# EAGLE design antenna_tracker (EAGLE 6.5.0)
DATABASE: C:/Users/Brandon Beggs/Documents/Projects/Utilities/digikeydb.txt

## Sheet 1 of 5
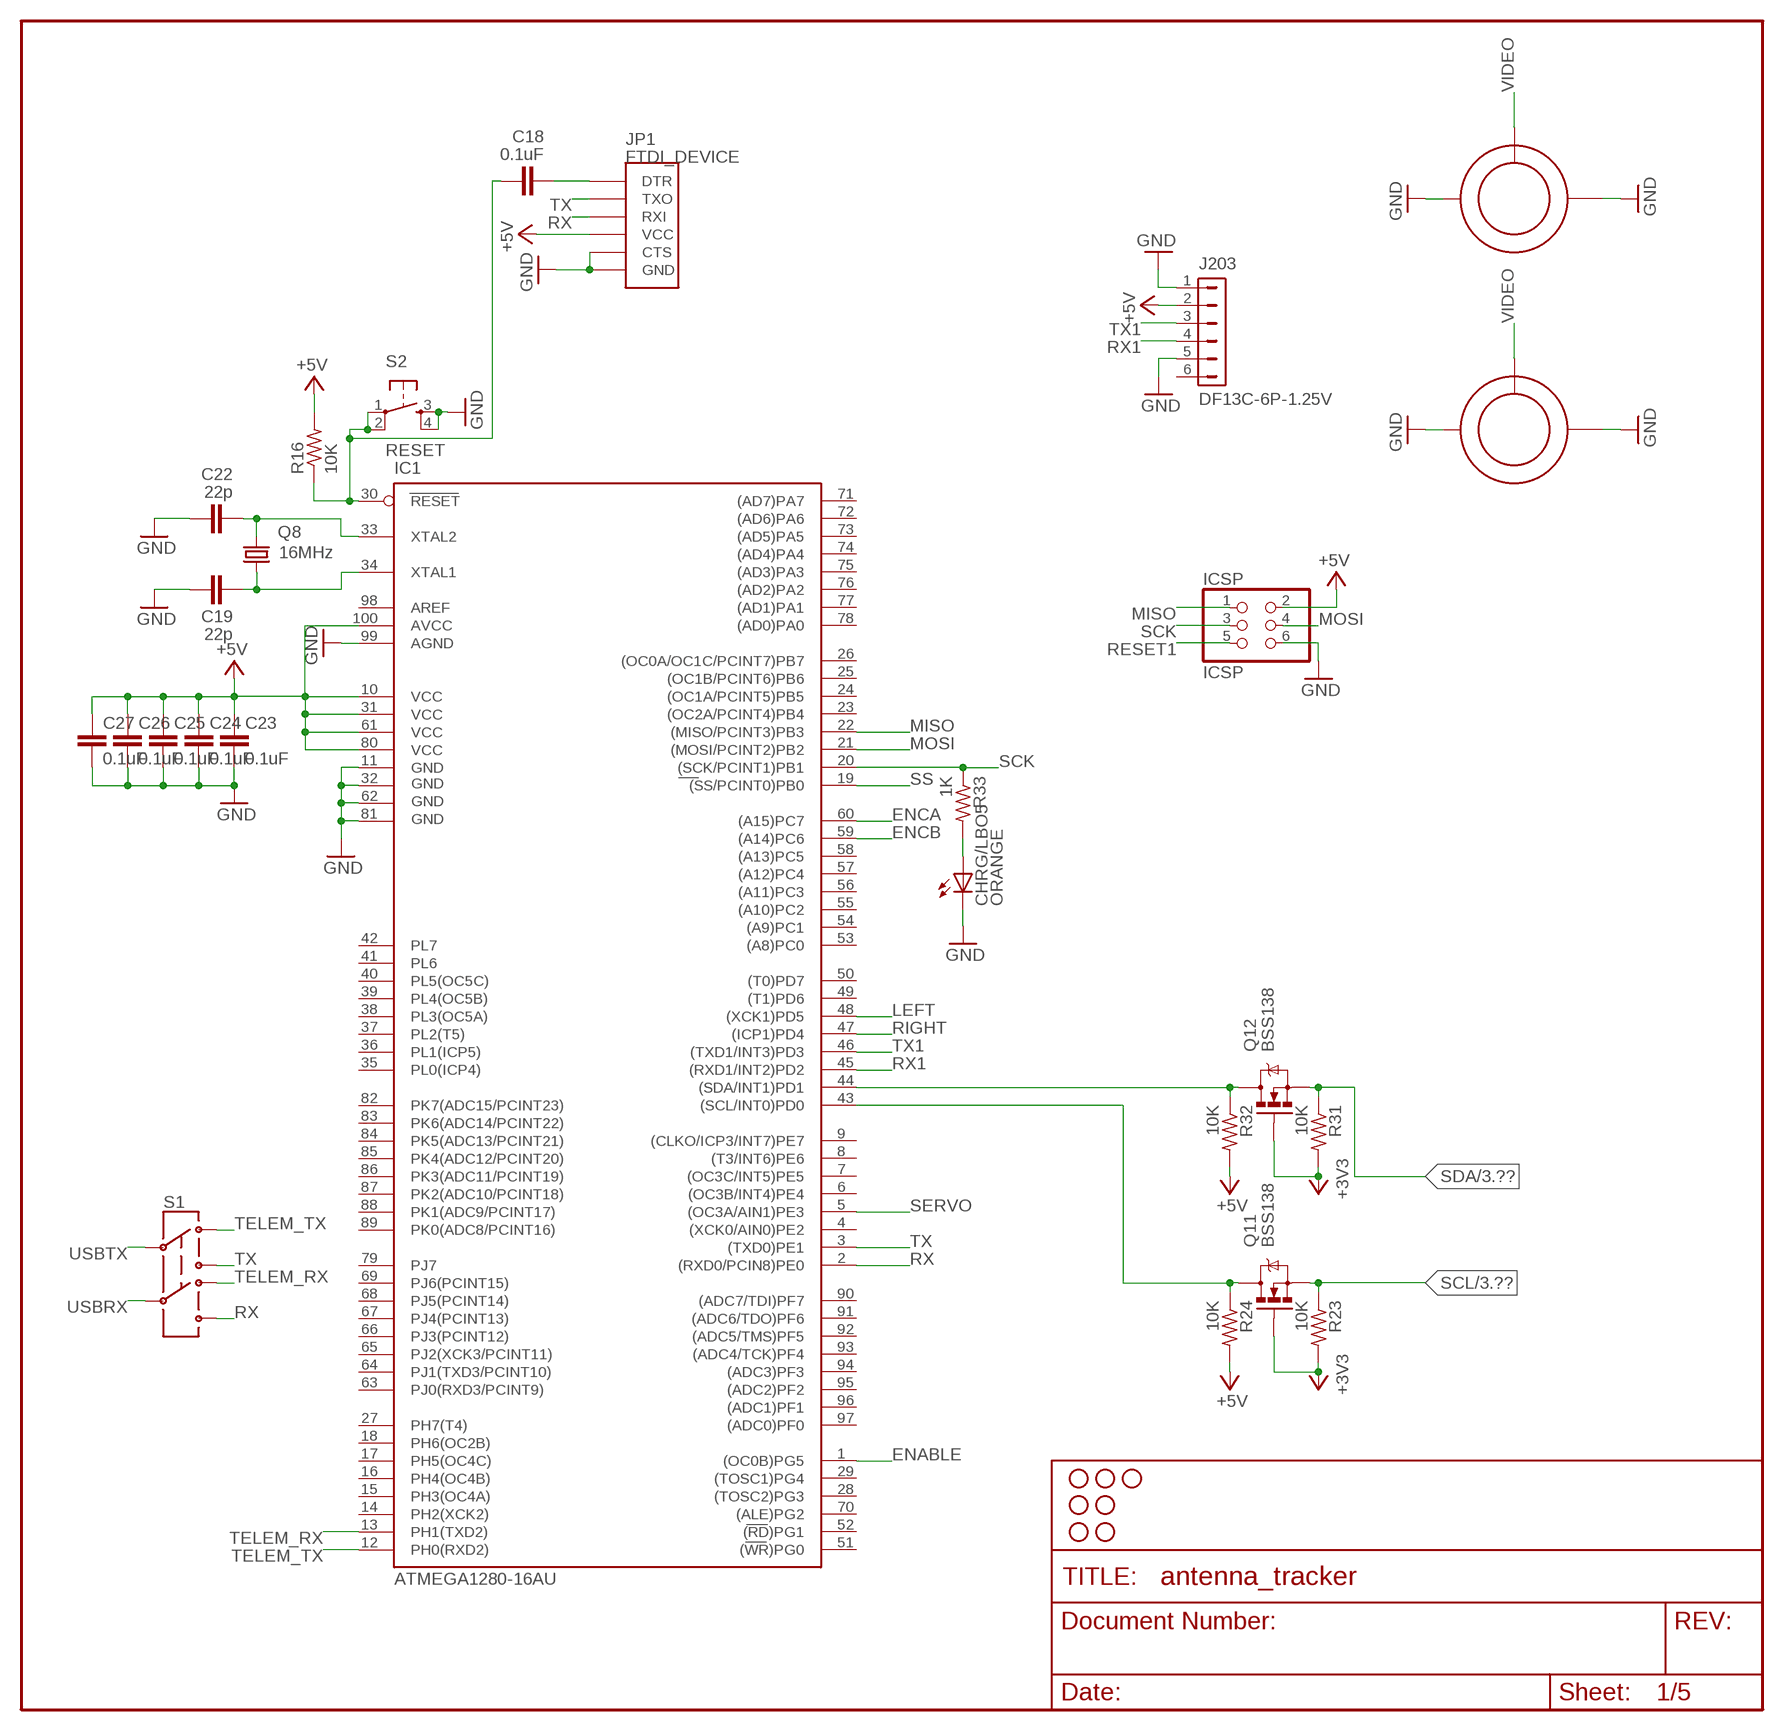
[diagram p0: schematic, sheet 1]

### Parts
C18  0.1uF  C-EUC0603K  [C0603K]
C19  22p  C-EUC0603K  [C0603K]
C22  22p  C-EUC0603K  [C0603K]
C23  0.1uF  C-EUC0603K  [C0603K]
C24  0.1uF  C-EUC0603K  [C0603K]
C25  0.1uF  C-EUC0603K  [C0603K]
C26  0.1uF  C-EUC0603K  [C0603K]
C27  0.1uF  C-EUC0603K  [C0603K]
CHRG/LBO5  ORANGE  LEDCHIP-LED0805  [CHIP-LED0805]
IC1  ATMEGA1280-16AU  [TQFP100]
ICSP  ICSP  PINHD-2X3  [2X03]
J203  DF13C-6P-1.25V  DF13-6P-1.25V  [DF13C-6P-1.25V]
JP1  FTDI_DEVICE  [FTDI_DEVICE_SIDE]
Q8  16MHz  CRYTALHC49S  [HC49/S]
Q11  BSS138  BSS138TRANS-00830  [SOT23-3]
Q12  BSS138  BSS138TRANS-00830  [SOT23-3]
R16  10K  R-US_R0805  [R0805]
R23  10K  R-US_R0805  [R0805]
R24  10K  R-US_R0805  [R0805]
R31  10K  R-US_R0805  [R0805]
R32  10K  R-US_R0805  [R0805]
R33  1K  R-US_M0805  [M0805]
S1  SWITCH-DPDTPTH  [MSS22]
S2  RESET  TAC_SWITCHPTH  [TACTILE-PTH]
STANDOFF1  STAND-OFF  [STAND-OFF]
STANDOFF2  STAND-OFF  [STAND-OFF]
STANDOFF3  STAND-OFF  [STAND-OFF]
STANDOFF4  STAND-OFF  [STAND-OFF]
STANDOFF5  STAND-OFF  [STAND-OFF]
STANDOFF6  STAND-OFF  [STAND-OFF]
STANDOFF7  STAND-OFF  [STAND-OFF]
U$10  RCA_VERTICAL  [RCA_VERTICAL]
U$11  RCA_VERTICAL  [RCA_VERTICAL]

### Nets
+3V3: Q11.1(G) Q12.1(G) R23.2 R31.2 ; also sheet 3,4
+5V: C23.1 C24.1 C25.1 C26.1 C27.1 IC1.10(VCC) IC1.31(VCC1) IC1.61(VCC2) IC1.80(VCC3) IC1.100(AVCC) ICSP.2 J203.2 JP1.P$4(VCC) R16.2 R24.2 R32.2 ; also sheet 2,4,5
ENABLE: IC1.1((OC0B)PG5) ; also sheet 2
ENCA: IC1.60((A15)PC7) ; also sheet 2
ENCB: IC1.59((A14)PC6) ; also sheet 2
GND: C19.1 C22.1 C23.2 C24.2 C25.2 C26.2 C27.2 CHRG/LBO5.C IC1.11(GND) IC1.32(GND1) IC1.62(GND2) IC1.81(GND3) IC1.99(AGND) ICSP.6 J203.1 J203.5 JP1.P$5(CTS) JP1.P$6(GND) S2.3 S2.4 U$10.P$1(GND) U$10.P$2(GND) U$11.P$1(GND) U$11.P$2(GND) ; also sheet 2,3,4,5
LEFT: IC1.48((XCK1)PD5) ; also sheet 2
MISO: IC1.22((MISO/PCINT3)PB3) ICSP.1
MOSI: IC1.21((MOSI/PCINT2)PB2) ICSP.4
N$18: C18.2 JP1.P$1(DTR)
N$20: C19.2 IC1.34(XTAL1) Q8.1
N$21: C22.2 IC1.33(XTAL2) Q8.2
N$22: IC1.44((SDA/INT1)PD1) Q12.3(D) R32.1
N$24: IC1.43((SCL/INT0)PD0) Q11.3(D) R24.1
N$27: CHRG/LBO5.A R33.2
RESET1: C18.1 IC1.30(RESET) ICSP.5 R16.1 S2.1 S2.2
RIGHT: IC1.47((ICP1)PD4) ; also sheet 2
RX: IC1.2((RXD0/PCIN8)PE0) JP1.P$3(RXI) S1.6
RX1: IC1.45((RXD1/INT2)PD2) J203.4
SCK: IC1.20((SCK/PCINT1)PB1) ICSP.3 R33.1
SCL: Q11.2(S) R23.1 ; also sheet 3
SDA: Q12.2(S) R31.1 ; also sheet 3
SERVO: IC1.5((OC3A/AIN1)PE3) ; also sheet 5
SS: IC1.19((SS/PCINT0)PB0)
TELEM_RX: IC1.13(PH1(TXD2)) S1.4 ; also sheet 4
TELEM_TX: IC1.12(PH0(RXD2)) S1.1 ; also sheet 4
TX: IC1.3((TXD0)PE1) JP1.P$2(TXO) S1.3
TX1: IC1.46((TXD1/INT3)PD3) J203.3
USBRX: S1.5 ; also sheet 4
USBTX: S1.2 ; also sheet 4
VIDEO: U$10.P$3(SIGNAL) U$11.P$3(SIGNAL) ; also sheet 4
Unconnected: IC1.4((XCK0/AIN0)PE2) IC1.6((OC3B/INT4)PE4) IC1.7((OC3C/INT5)PE5) IC1.8((T3/INT6)PE6) IC1.9((CLKO/ICP3/INT7)PE7) IC1.14(PH2(XCK2)) IC1.15(PH3(OC4A)) IC1.16(PH4(OC4B)) IC1.17(PH5(OC4C)) IC1.18(PH6(OC2B)) IC1.23((OC2A/PCINT4)PB4) IC1.24((OC1A/PCINT5)PB5) IC1.25((OC1B/PCINT6)PB6) IC1.26((OC0A/OC1C/PCINT7)PB7) IC1.27(PH7(T4)) IC1.28((TOSC2)PG3) IC1.29((TOSC1)PG4) IC1.35(PL0(ICP4)) IC1.36(PL1(ICP5)) IC1.37(PL2(T5)) IC1.38(PL3(OC5A)) IC1.39(PL4(OC5B)) IC1.40(PL5(OC5C)) IC1.41(PL6) IC1.42(PL7) IC1.49((T1)PD6) IC1.50((T0)PD7) IC1.51((WR)PG0) IC1.52((RD)PG1) IC1.53((A8)PC0) IC1.54((A9)PC1) IC1.55((A10)PC2) IC1.56((A11)PC3) IC1.57((A12)PC4) IC1.58((A13)PC5) IC1.63(PJ0(RXD3/PCINT9)) IC1.64(PJ1(TXD3/PCINT10)) IC1.65(PJ2(XCK3/PCINT11)) IC1.66(PJ3(PCINT12)) IC1.67(PJ4(PCINT13)) IC1.68(PJ5(PCINT14)) IC1.69(PJ6(PCINT15)) IC1.70((ALE)PG2) IC1.71((AD7)PA7) IC1.72((AD6)PA6) IC1.73((AD5)PA5) IC1.74((AD4)PA4) IC1.75((AD3)PA3) IC1.76((AD2)PA2) IC1.77((AD1)PA1) IC1.78((AD0)PA0) IC1.79(PJ7) IC1.82(PK7(ADC15/PCINT23)) IC1.83(PK6(ADC14/PCINT22)) IC1.84(PK5(ADC13/PCINT21)) IC1.85(PK4(ADC12/PCINT20)) IC1.86(PK3(ADC11/PCINT19)) IC1.87(PK2(ADC10/PCINT18)) IC1.88(PK1(ADC9/PCINT17)) IC1.89(PK0(ADC8/PCINT16)) IC1.90((ADC7/TDI)PF7) IC1.91((ADC6/TDO)PF6) IC1.92((ADC5/TMS)PF5) IC1.93((ADC4/TCK)PF4) IC1.94((ADC3)PF3) IC1.95((ADC2)PF2) IC1.96((ADC1)PF1) IC1.97((ADC0)PF0) IC1.98(AREF) J203.6

## Sheet 2 of 5
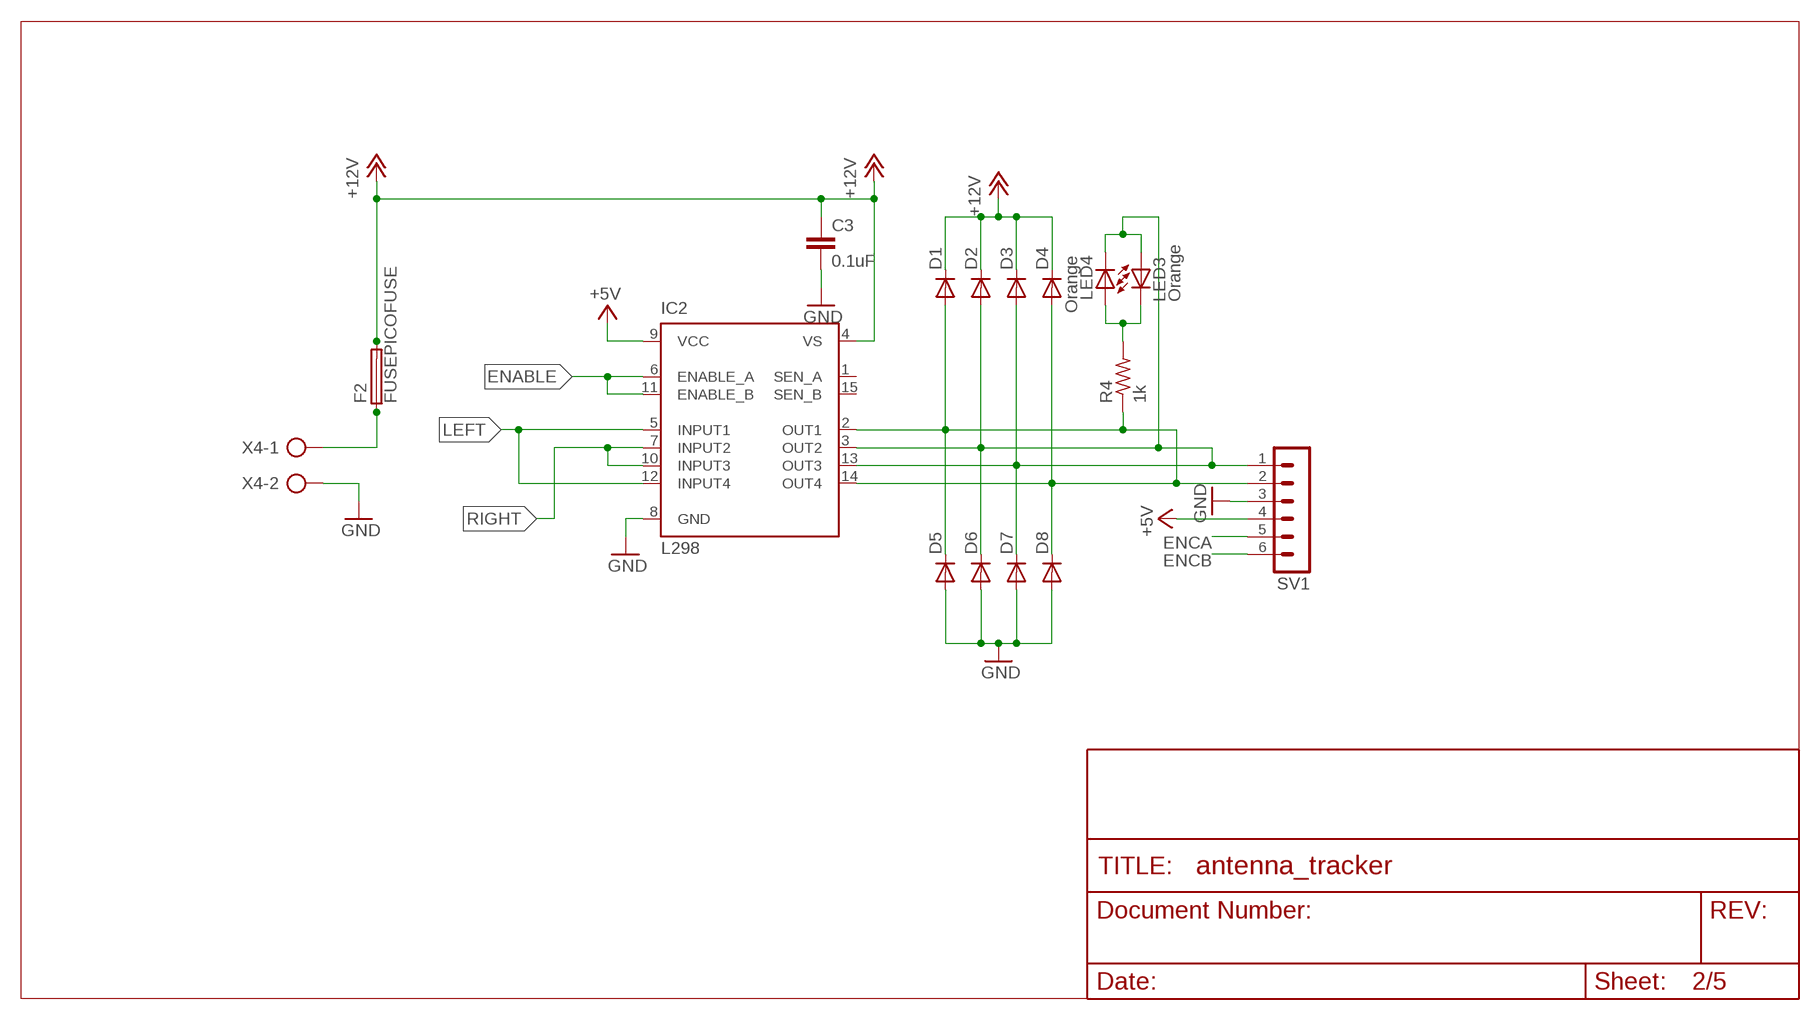
[diagram p1: schematic, sheet 2]

### Parts
C3  0.1uF  0.1UF-100V-10%(0603)  [0603-CAP]
D1  DIODE-DO214AC  [DO214AC]
D2  DIODE-DO214AC  [DO214AC]
D3  DIODE-DO214AC  [DO214AC]
D4  DIODE-DO214AC  [DO214AC]
D5  DIODE-DO214AC  [DO214AC]
D6  DIODE-DO214AC  [DO214AC]
D7  DIODE-DO214AC  [DO214AC]
D8  DIODE-DO214AC  [DO214AC]
F2  FUSEPICOFUSE  [PICOFUSE]
IC2  L298  [MULTIWATT-15]
LED3  Orange  LEDSML0805  [SML0805]
LED4  Orange  LEDSML0805  [SML0805]
R4  1k  R-US_R0805  [R0805]
SV1  MA06-1  [MA06-1]
X4  AK300/2  [AK300/2]

### Nets
+5V: IC2.9(VCC) SV1.4 ; also sheet 1,4,5
+12V: C3.1 D1.C D2.C D3.C D4.C F2.2 IC2.4(VS) ; also sheet 5
ENABLE: IC2.6(ENABLE_A) IC2.11(ENABLE_B) ; also sheet 1
ENCA: SV1.5 ; also sheet 1
ENCB: SV1.6 ; also sheet 1
GND: C3.2 D5.A D6.A D7.A D8.A IC2.8(GND) SV1.3 X4.2 ; also sheet 1,3,4,5
LEFT: IC2.5(INPUT1) IC2.12(INPUT4) ; also sheet 1
N$8: D2.A D3.A D6.C D7.C IC2.3(OUT2) IC2.13(OUT3) LED3.A LED4.C SV1.1
N$10: D1.A D4.A D5.C D8.C IC2.2(OUT1) IC2.14(OUT4) R4.1 SV1.2
N$13: LED3.C LED4.A R4.2
N$25: F2.1 X4.1
RIGHT: IC2.7(INPUT2) IC2.10(INPUT3) ; also sheet 1
Unconnected: IC2.1(SEN_A) IC2.15(SEN_B)

## Sheet 3 of 5
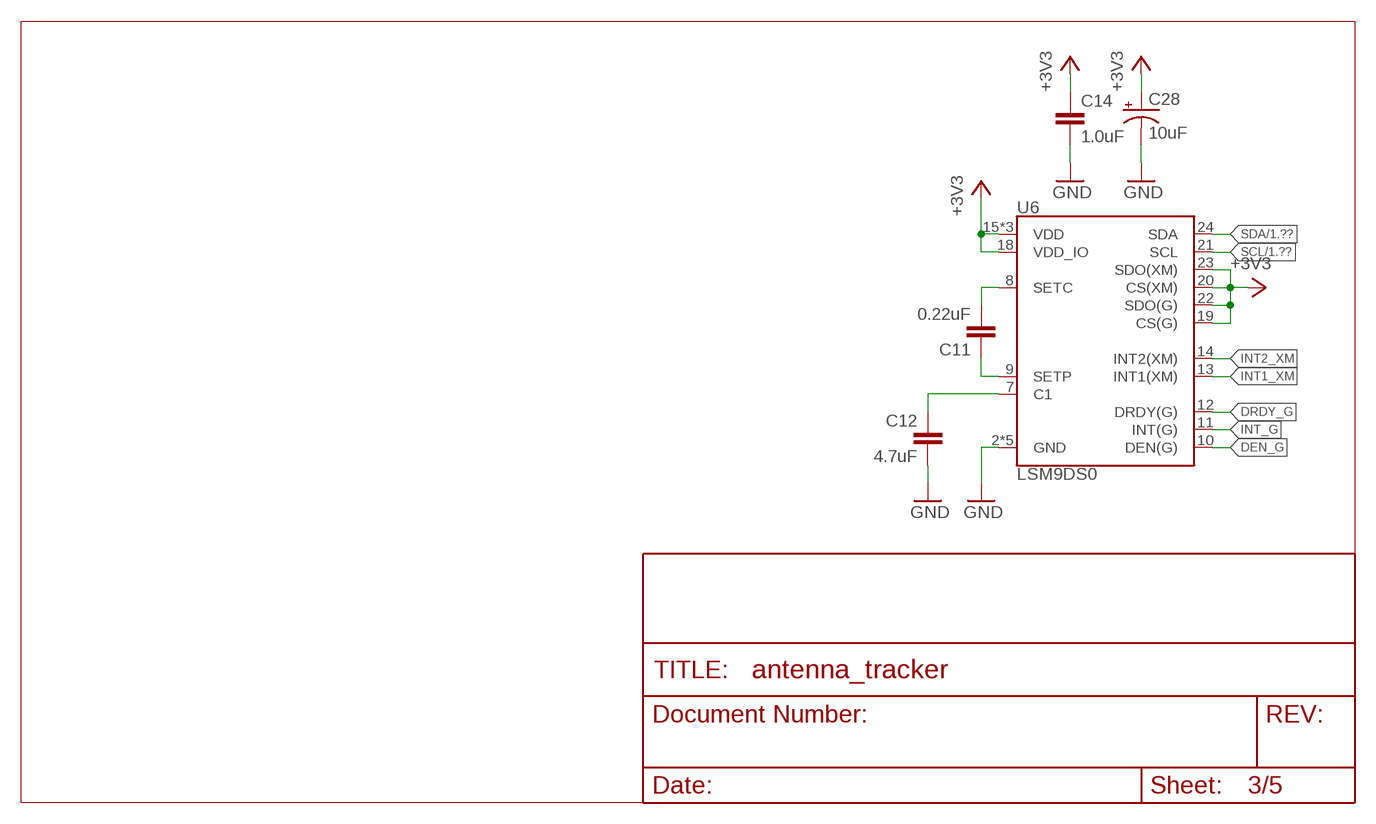
[diagram p2: schematic, sheet 3]

### Parts
C11  0.22uF  0.22UF-25V-10%(0603)  [0603-CAP]
C12  4.7uF  4.7UF-6.3V-10%(0603)0603  [0603-CAP]
C14  1.0uF  1.0UF-16V-10%(0603)  [0603-CAP]
C28  10uF  10UF-16V-10%(TANT)  [EIA3216]
U6  LSM9DS0  [LGA-24]

### Nets
+3V3: C14.1 C28.A(+) U6.15(VDD) U6.16(VDD) U6.17(VDD) U6.18(VDD_IO) U6.19(CS(G)) U6.20(CS(XM)) U6.22(SDO(G)) U6.23(SDO(XM)) ; also sheet 1,4
DEN_G: U6.10(DEN(G))
DRDY_G: U6.12(DRDY(G))
GND: C12.2 C14.2 C28.C(-) U6.2(GND) U6.3(GND) U6.4(GND) U6.5(GND) U6.6(GND) ; also sheet 1,2,4,5
INT1_XM: U6.13(INT1(XM))
INT2_XM: U6.14(INT2(XM))
INT_G: U6.11(INT(G))
N$7: C11.1 U6.9(SETP)
N$28: C11.2 U6.8(SETC)
N$29: C12.1 U6.7(C1)
SCL: U6.21(SCL) ; also sheet 1
SDA: U6.24(SDA) ; also sheet 1

## Sheet 4 of 5
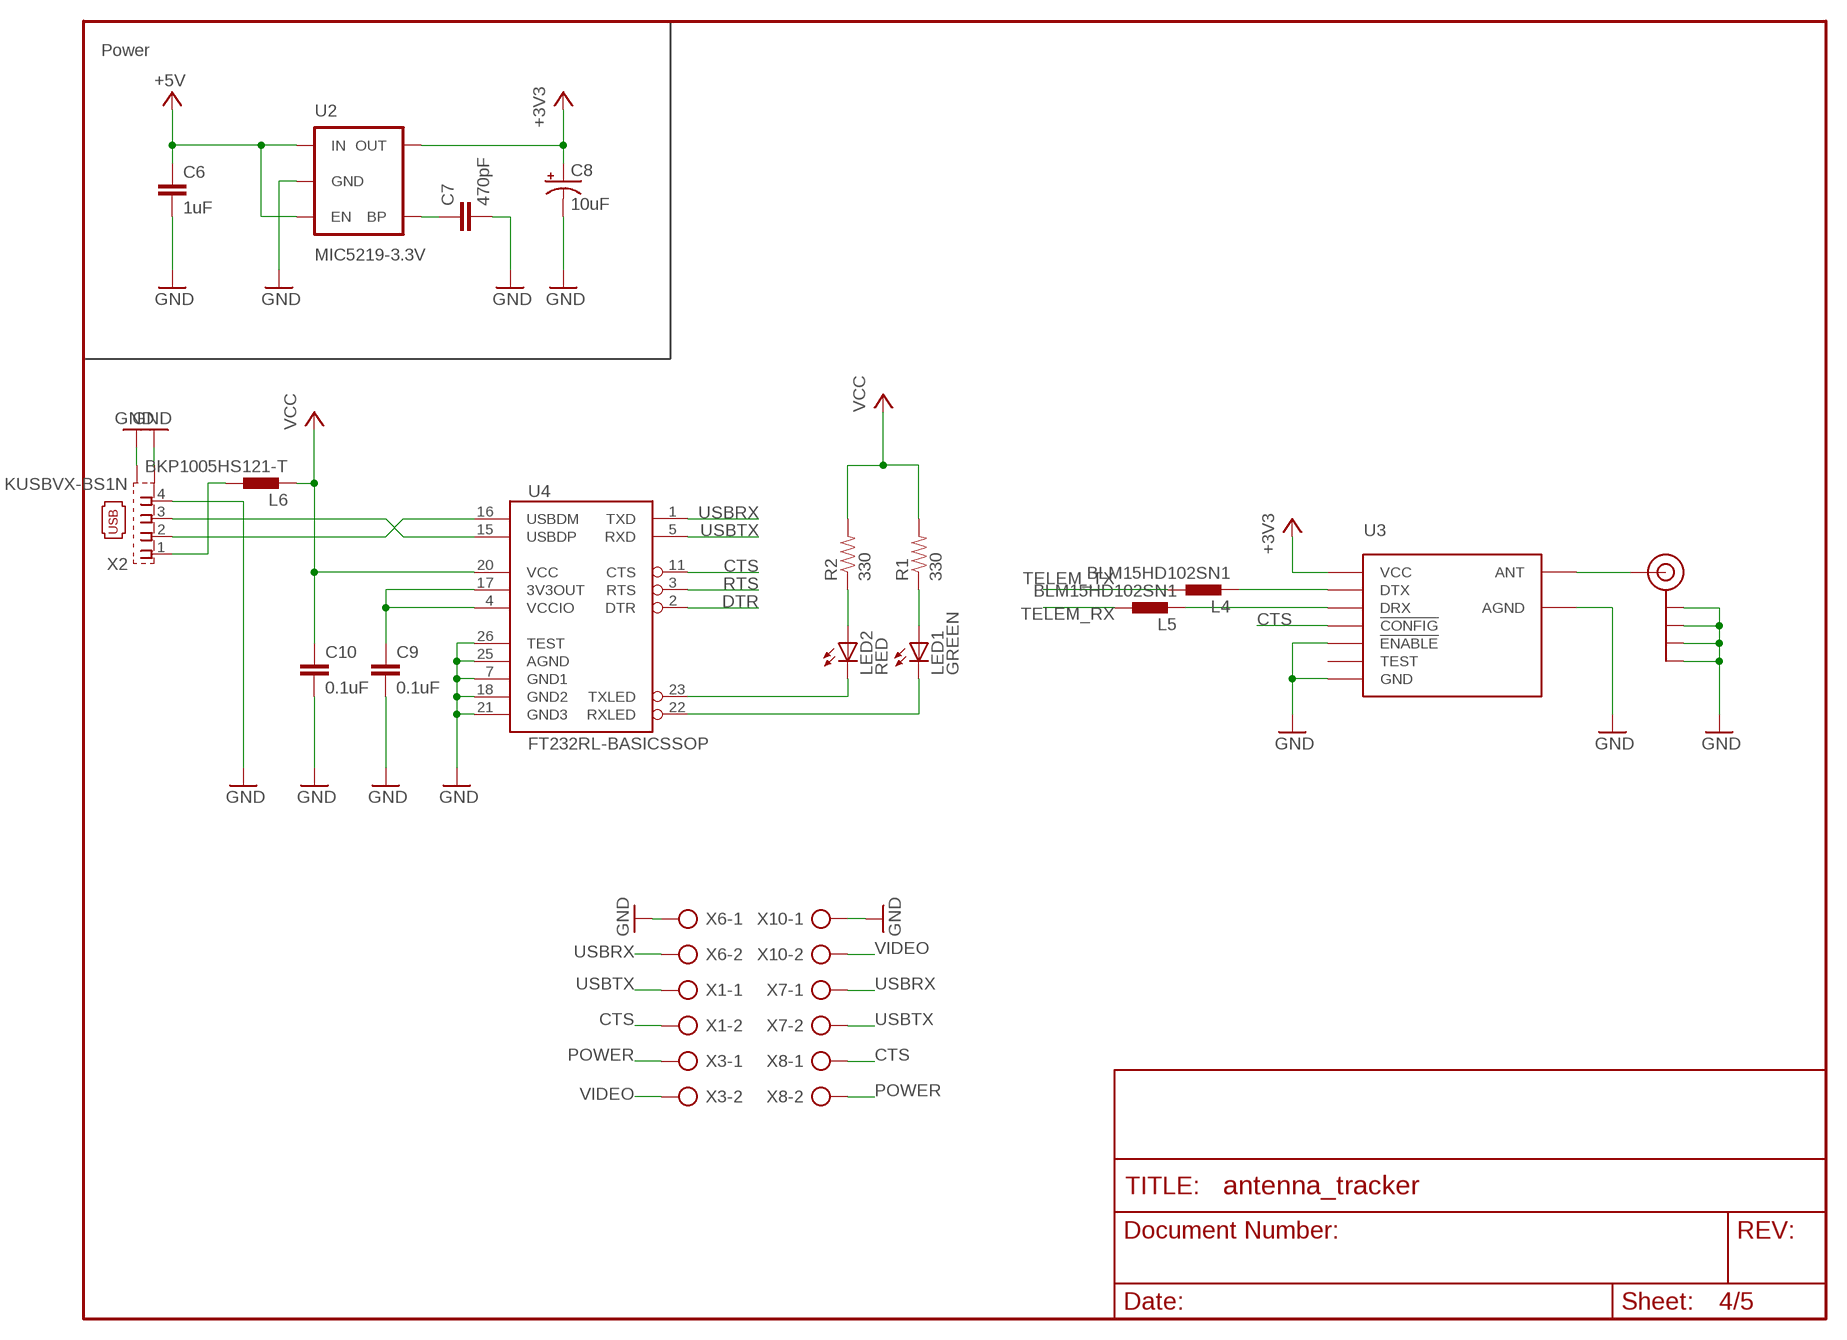
[diagram p3: schematic, sheet 4]

### Parts
C6  1uF  CAP0402-CAP  [0402-CAP]
C7  470pF  CAP0402-CAP  [0402-CAP]
C8  10uF  CAP_POL1206  [EIA3216]
C9  0.1uF  C-EUC0603K  [C0603K]
C10  0.1uF  C-EUC0603K  [C0603K]
J$1  SMA_EDGE  [SMA-EDGE]
L4  BLM15HD102SN1  INDUCTOR-0402  [0402-IND]
L5  BLM15HD102SN1  INDUCTOR-0402  [0402-IND]
L6  BKP1005HS121-T  INDUCTOR-0402  [0402-IND]
LED1  GREEN  LEDCHIP-LED0805  [CHIP-LED0805]
LED2  RED  LEDCHIP-LED0805  [CHIP-LED0805]
R1  330  RESISTOR0402-RES  [0402-RES]
R2  330  RESISTOR0402-RES  [0402-RES]
U2  MIC5219-3.3V  V_REG_LDOSMD  [SOT23-5]
U3  HM-TRPSMD  [HM-TRP-SMD]
U4  FT232RL-BASICSSOP  [SSOP28DB]
X1  AK300/2  [AK300/2]
X2  KUSBVX-BS1N  [KUSBVX-BS1N]
X3  AK300/2  [AK300/2]
X6  AK300/2  [AK300/2]
X7  AK300/2  [AK300/2]
X8  AK300/2  [AK300/2]
X10  AK300/2  [AK300/2]

### Nets
+3V3: C8.A(+) U2.5(OUT) U3.VCC ; also sheet 1,3
+5V: C6.1 U2.1(IN) U2.3(EN) ; also sheet 1,2,5
CTS: U3.!CONFIG U4.11(CTS) X1.2 X8.1
DTR: U4.2(DTR)
GND: C6.2 C7.2 C8.C(-) C9.2 C10.2 J$1.GND@0(GND) J$1.GND@1(GND) J$1.GND@2(GND) J$1.GND@3(GND) U2.2(GND) U3.!ENABLE U3.AGND U3.GND U4.7(GND1) U4.18(GND2) U4.21(GND3) U4.25(AGND) U4.26(TEST) X2.4 X2.M1(S1) X2.M2(S2) X6.1 X10.1 ; also sheet 1,2,3,5
N$2: C7.1 U2.4(BP)
N$5: J$1.SIG(SIGNAL) U3.ANT
N$6: C9.1 U4.4(VCCIO) U4.17(3V3OUT)
N$9: U4.16(USBDM) X2.2
N$11: LED2.A R2.1
N$12: LED1.A R1.1
N$14: LED2.C U4.23(TXLED)
N$15: LED1.C U4.22(RXLED)
N$16: L4.P$2 U3.DTX
N$17: L5.P$2 U3.DRX
N$23: L6.P$1 X2.1
N$26: U4.15(USBDP) X2.3
POWER: X3.1 X8.2
RTS: U4.3(RTS)
TELEM_RX: L5.P$1 ; also sheet 1
TELEM_TX: L4.P$1 ; also sheet 1
USBRX: U4.1(TXD) X6.2 X7.1 ; also sheet 1
USBTX: U4.5(RXD) X1.1 X7.2 ; also sheet 1
VCC: C10.1 L6.P$2 R1.2 R2.2 U4.20(VCC)
VIDEO: X3.2 X10.2 ; also sheet 1
Unconnected: U3.TEST

### Notes on the sheet
- Power

## Sheet 5 of 5
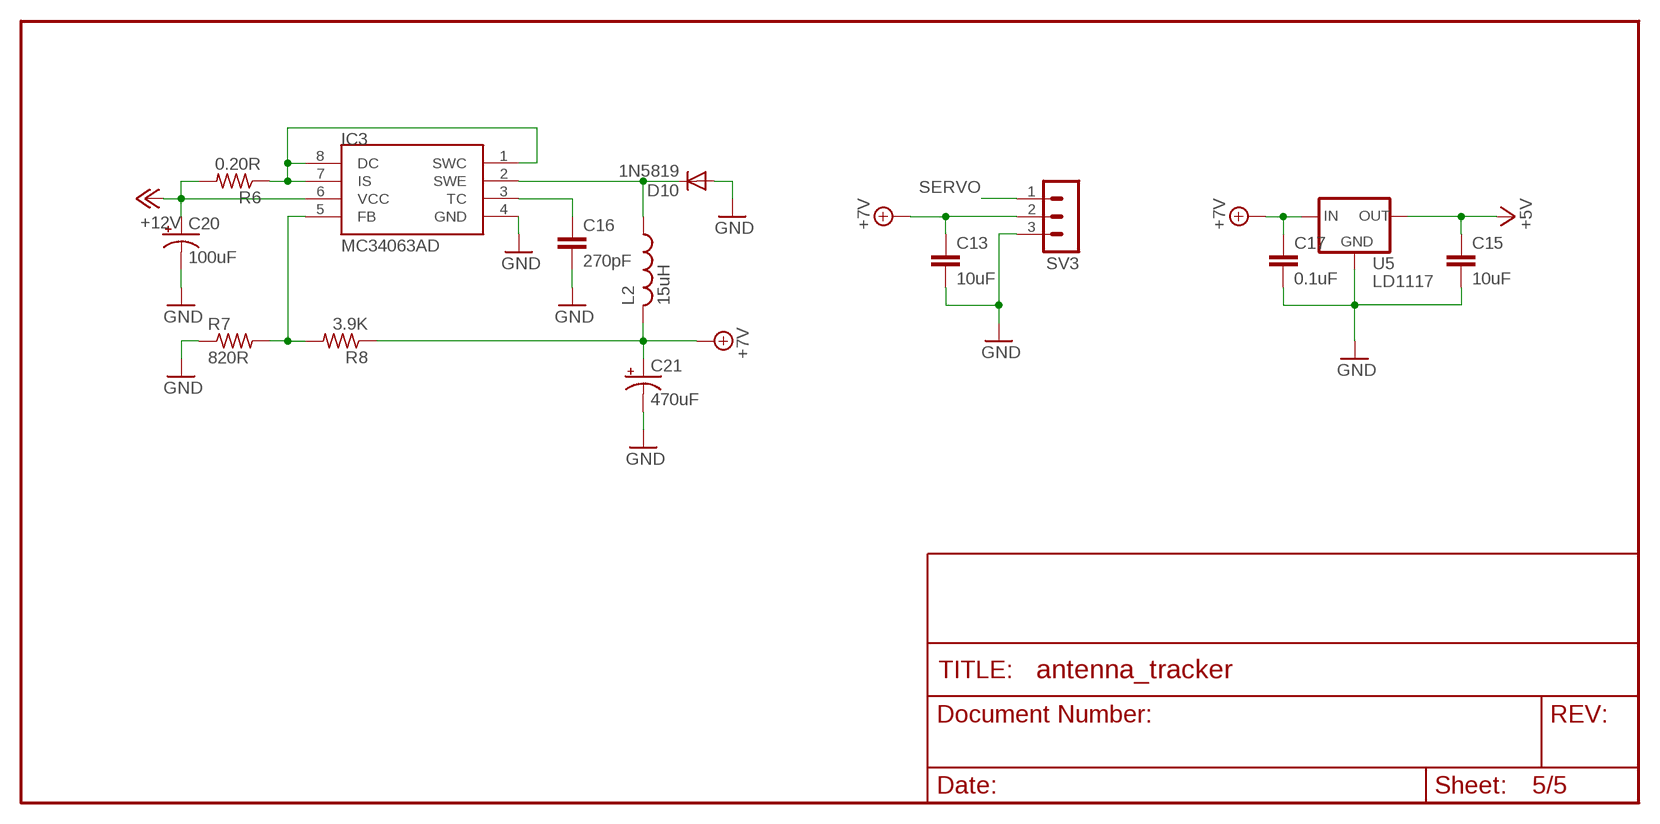
[diagram p4: schematic, sheet 5]

### Parts
C13  10uF  C-EUC0805K  [C0805K]
C15  10uF  C-EUC0805K  [C0805K]
C16  270pF  C-EUC0603K  [C0603K]
C17  0.1uF  C-EUC0603K  [C0603K]
C20  100uF  CPOL-USE2,5-6E  [E2,5-6E]
C21  470uF  CPOL-USE3.5-8  [E3,5-8]
D10  1N5819  DIODE-SOD123  [SOD123]
IC3  MC34063AD  [SOIC8]
L2  15uH  L-USWE-TPC  [POWER-CHOKE_WE-TPC]
R6  0.20R  R-US_R0603  [R0603]
R7  820R  R-US_R0603  [R0603]
R8  3.9K  R-US_R0603  [R0603]
SV3  MA03-1  [MA03-1]
U5  LD1117  V_REG_MC33269DT  [DPAK]

### Nets
+5V: C15.1 U5.4(OUT) ; also sheet 1,2,4
+7V: C13.1 C17.1 C21.+ L2.2 R8.1 SV3.2 U5.3(IN)
+12V: C20.+ IC3.6(VCC) R6.2 ; also sheet 2
GND: C13.2 C15.2 C16.2 C17.2 C20.- C21.- D10.A IC3.4(GND) R7.1 SV3.3 U5.1(GND) ; also sheet 1,2,3,4
N$19: C16.1 IC3.3(TC)
N$30: IC3.1(SWC) IC3.7(IS) IC3.8(DC) R6.1
N$31: IC3.5(FB) R7.2 R8.2
N$32: D10.C IC3.2(SWE) L2.1
SERVO: SV3.1 ; also sheet 1

## Library data of the parts
C3 = SparkFun-Capacitors:0.1UF-100V-10%(0603): CAP-08390; PARTNO: GRM188R71E104KA01D; PROD_ID: CAP-08390
C6 = SparkFun:CAP: Capacitor Standard 0603 ceramic capacitor, and 0.1" leaded capacitor.; PARTNO: C0603C105K8PACTU
C7 = SparkFun:CAP: Capacitor Standard 0603 ceramic capacitor, and 0.1" leaded capacitor.; PARTNO: GRM1555C1H471JA01D
C8 = SparkFun:CAP_POL: Capacitor Polarized These are standard SMD and PTH capacitors. Normally 10uF, 47uF, and 100uF in electrolytic and tantalum varieties. Always verify the external diameter of the through hole cap, it varies with capacity, voltage, and manufacturer. The EIA devices should be standard.; PARTNO: EEE-1CA100SR
C9 C10 = resistor:C-EU: CAPACITOR, European symbol; PARTNO: GRM188R71E104KA01D
C11 = SparkFun-Capacitors:0.22UF-25V-10%(0603): CAP-07822; PARTNO: CL10B224KA8NNNC; PROD_ID: CAP-07822
C12 = SparkFun-Capacitors:4.7UF-6.3V-10%(0603): CAP-08280; PARTNO: CL10B475KQ8NQNC; PROD_ID: CAP-08280
C13 C15 = rcl:C-EU: CAPACITOR, European symbol; PARTNO: CL21A106KAFN3NE
C14 = SparkFun-Capacitors:1.0UF-16V-10%(0603): CAP-00868; PARTNO: C0603C105K8PACTU; PROD_ID: CAP-00868
C16 = resistor:C-EU: CAPACITOR, European symbol; PARTNO: CC0603KRX7R9BB271
C17 C18 C23-C27 = rcl:C-EU: CAPACITOR, European symbol; PARTNO: GRM188R71E104KA01D
C19 C22 = rcl:C-EU: CAPACITOR, European symbol; PARTNO: C0805C220J5GACTU
C20 = rcl:CPOL-US: POLARIZED CAPACITOR, American symbol; PARTNO: ESK107M025AE3AA
C21 = rcl:CPOL-US: POLARIZED CAPACITOR, American symbol; PARTNO: UVR1C471MPD
C28 = SparkFun-Capacitors:10UF-16V-10%(TANT): CAP-00811 1206/EIA-3216 Tantalum capacitor; PARTNO: EEE-1CA100SR; PROD_ID: CAP-00811
CHRG/LBO5 = adafruit:LED: LED; PARTNO: APT2012SECK
D1-D8 = diode:DIODE-: DIODE; PARTNO: ES2B-LTP
D10 = diode:DIODE-: DIODE; PARTNO: 1N5819HW-7-F
F2 = fuse:FUSE: Fuse; OC_FARNELL: unknown; OC_NEWARK: unknown; PARTNO: RUEF700-2
IC1 = atmel-2005:ATMEGA*: MICROCONTROLLER 64/128/256 Kbytes FLASH 4 Kbytes EEPROM 8 Kbytes SRAM 86 General Purpose I/O pins 12-channels16-bit PWM 4 x Serial USARTs 16-channels 10-bit A/D
IC2 = st-microelectronics:L298: DUAL FULL-BRIDGE DRIVER; MPN: L298N; OC_FARNELL: 1589425; OC_NEWARK: 32M1527
IC3 = mc34063:MC34063; PARTNO: MC34063ECD-TR
ICSP = pinhead:PINHD-2X3: PIN HEADER; PARTNO: PPTC032LFBN-RC
J203 = con-hirose-df13:DF13-6P-1.25: DF13-6P 1.25mm Pitch Miniature Crimping Connector.; PARTNO: DF13C-6P-1.25V(20)
J$1 = 3DRobotics:SMA_EDGE: SMA Antenna Connector End launch SMA connector. The paste layer has been removed so that the connector can be hand soldered onto the board after reflow.; PARTNO: 0732511150
JP1 = SparkFun-Connectors:FTDI_DEVICE: Connector which mates to FTDI basic or FTDI cable.; PARTNO: PREC040SFAN-RC
L2 = rcl:L-US: INDUCTOR, American symbol; PARTNO: NR6028T150M
L4 L5 = pel_dipol_comp:INDUCTOR; PARTNO: BLM15HD102SN1D
L6 = pel_dipol_comp:INDUCTOR; PARTNO: BKP1005HS121-T
LED1 = led:LED: LED; PARTNO: LG R971-KN-1
LED2 = led:LED: LED; PARTNO: LH R974-LP-1
LED3 LED4 = led:LED: LED; PARTNO: APT2012SECK
Q8 = crystal:CRYTAL: CRYSTAL; PARTNO: ATS16B
Q11 Q12 = SparkFun-DiscreteSemi:BSS138: NMOSFET, Enh Mode 50V/6-ohm 200mA (SOT-23) TRANS-00830; PARTNO: BSS138; PROD_ID: TRANS-00830
R1 R2 = SparkFun:RESISTOR: Resistor Basic schematic elements and footprints for 0603, 1206, and PTH resistors.; PARTNO: MCR01MRTF3300
R4 = resistor:R-US_: RESISTOR, American symbol; PARTNO: RMCF0805JT1K00
R6 = rcl:R-US_: RESISTOR, American symbol; PARTNO: 73L2R20J
R7 = resistor:R-US_: RESISTOR, American symbol; PARTNO: 1623097-1
R8 = rcl:R-US_: RESISTOR, American symbol; PARTNO: RMCF0603JT3K90
R16 R23 R24 R31 R32 = adafruit:R-US_: RESISTOR, American symbol; PARTNO: 1623097-1
R33 = adafruit:R-US_: RESISTOR, American symbol; PARTNO: RMCF0805JT1K00
S1 = SparkFun-Electromechanical:SWITCH-DPDT: DPDT Version of the COM-00597; PARTNO: 1825261-2
S2 = SparkFun-Electromechanical:TAC_SWITCH: Momentary Switch Button commonly used for reset or general input. Spark Fun Electronics SKU : COM-00097 SMT- SWCH-08247; PARTNO: 1825910-6
STANDOFF1-STANDOFF7 = SparkFun-Electromechanical:STAND-OFF: #4 Stand Off This is the mechanical footprint for a #4 phillips button head screw. Use the keepout ring to avoid running the screw head into surrounding components. SKU : PRT-00447
SV1 = con-lstb:MA06-1: PIN HEADER; OC_FARNELL: unknown; OC_NEWARK: unknown; PARTNO: PREC040SFAN-RC
SV3 = con-lstb:MA03-1: PIN HEADER; OC_FARNELL: unknown; OC_NEWARK: unknown; PARTNO: PREC040SFAN-RC
U2 = SparkFun:V_REG_LDO: Voltage Regulator LDO Standard 150mA LDO voltage regulator in SOT-23 layout. Micrel part MIC5205. BP (by-pass) pin is used to lower output noise with 470pF cap.; PARTNO: MIC5219-3.3YM5 TR
U3 = 3DRobotics:HM-TRP: HM-TRP Series 100mW Transceiver module HM-TRP series is a low cost, high performance transparent FSK transceiver with operating at 433/470/868/915 MHz. It features small size, high output power, high sensitivity, long transmission distance and high communication data rate with auto set up for communication change and data receiving and transmission control. There is UART interface, it is easy to realize the wireless data transmission with only providing the UART data. It is flexible for the users to set the UART baud rate, frequency, output power, data rate, frequency deviation, receiving bandwidth etc parameters. It is your ideal choice for designing wireless data transmission products which can be widely used on wireless data transmission field.
U4 = SparkFun:FT232RL-BASIC: USB UART This is the simplified version of the FT232RL unit. Only what you need, nothing you don't. Spark Fun Electronics SKU : COM-00650; PARTNO: FT232RL-REEL
U5 = SparkFun-PowerIC:V_REG_MC33269; PARTNO: LD1117DT50CTR
U6 = SparkFun-DigitalIC:LSM9DS0: LSM9DS0 3D Accelerometer, 3D Gyroscope, 3D Magnetomter Features: 3 acceleration channels, 3 angular rate channels, 3 magnetic field channels ±2/±4/±6/±8/±16 g linear acceleration full scale ±2/±4/±8/±12 gauss magnetic full scale ±245/±500/±2000 dps angular rate full scale 16-bit data output SPI / I2C serial interfaces Analog supply voltage 2.4 V to 3.6 V Power-down mode / low-power mode Programmable interrupt generators Embedded self-test Embedded temperature sensor Embedded FIFO Position and motion detection functions Click/double-click recognition
U$10 U$11 = antenna_tracker:RCA_VERTICAL; PARTNO: RCJ-021
X1 X3 X4 X6-X8 X10 = con-ptr500:AK300/2: CONNECTOR; OC_FARNELL: unknown; OC_NEWARK: unknown; PARTNO: OSTTC022162
X2 = con-kycon:KUSBVX-BS1N: USB B-type Receptacle Vertical, 4 Position, Through Hole Source: Sibalco Kycon KUSBVX-BS1N-xxx.pdf; PARTNO: 5787834-1

## Board
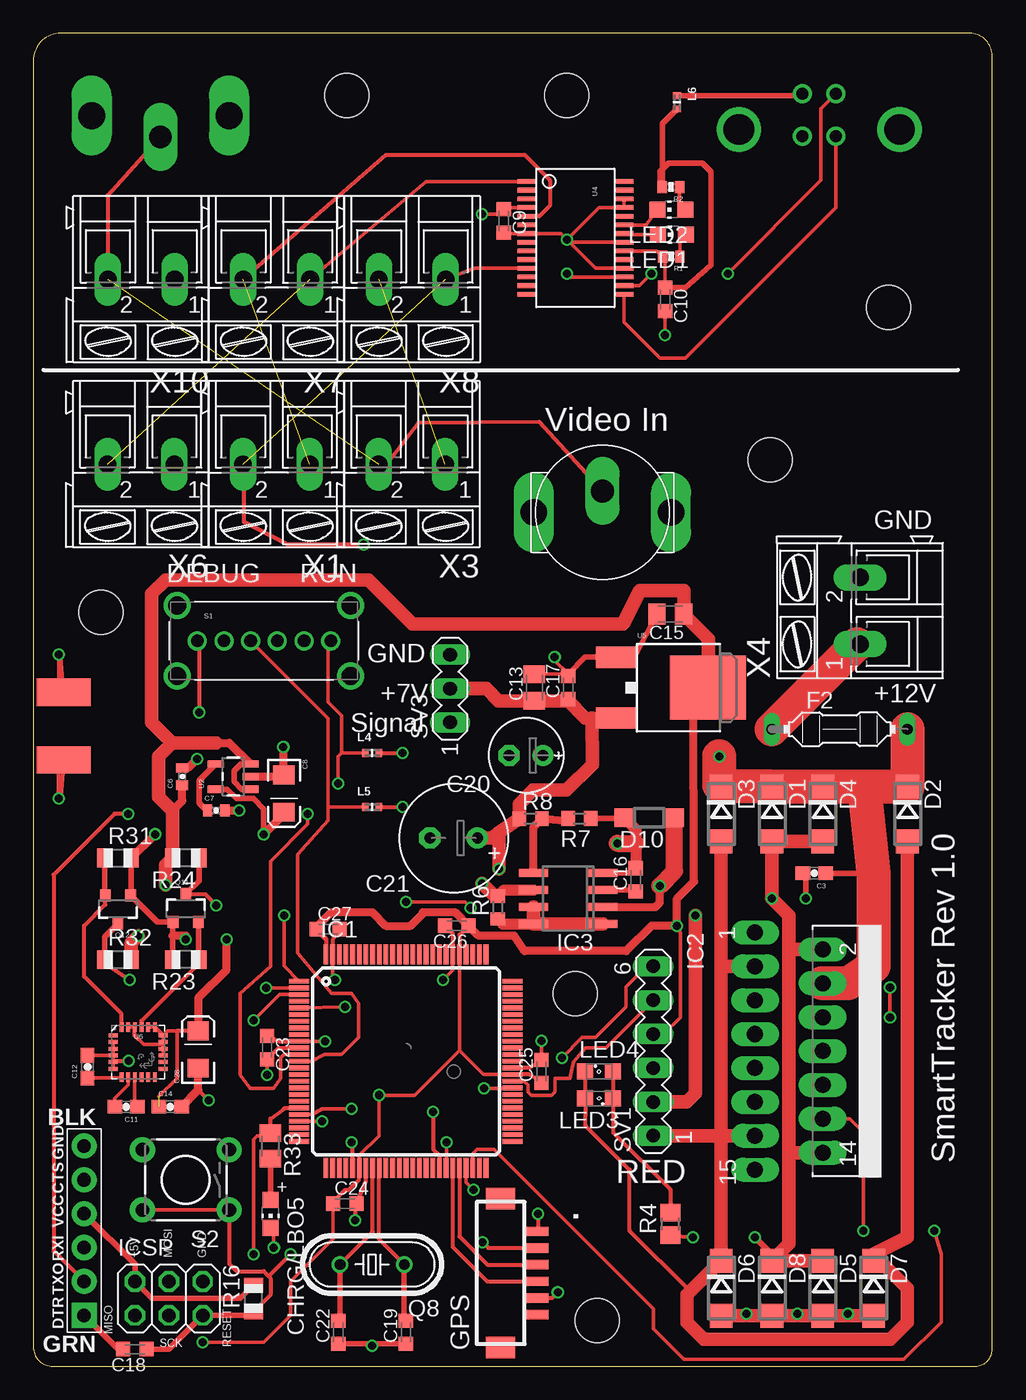
[diagram p5: board, top side]
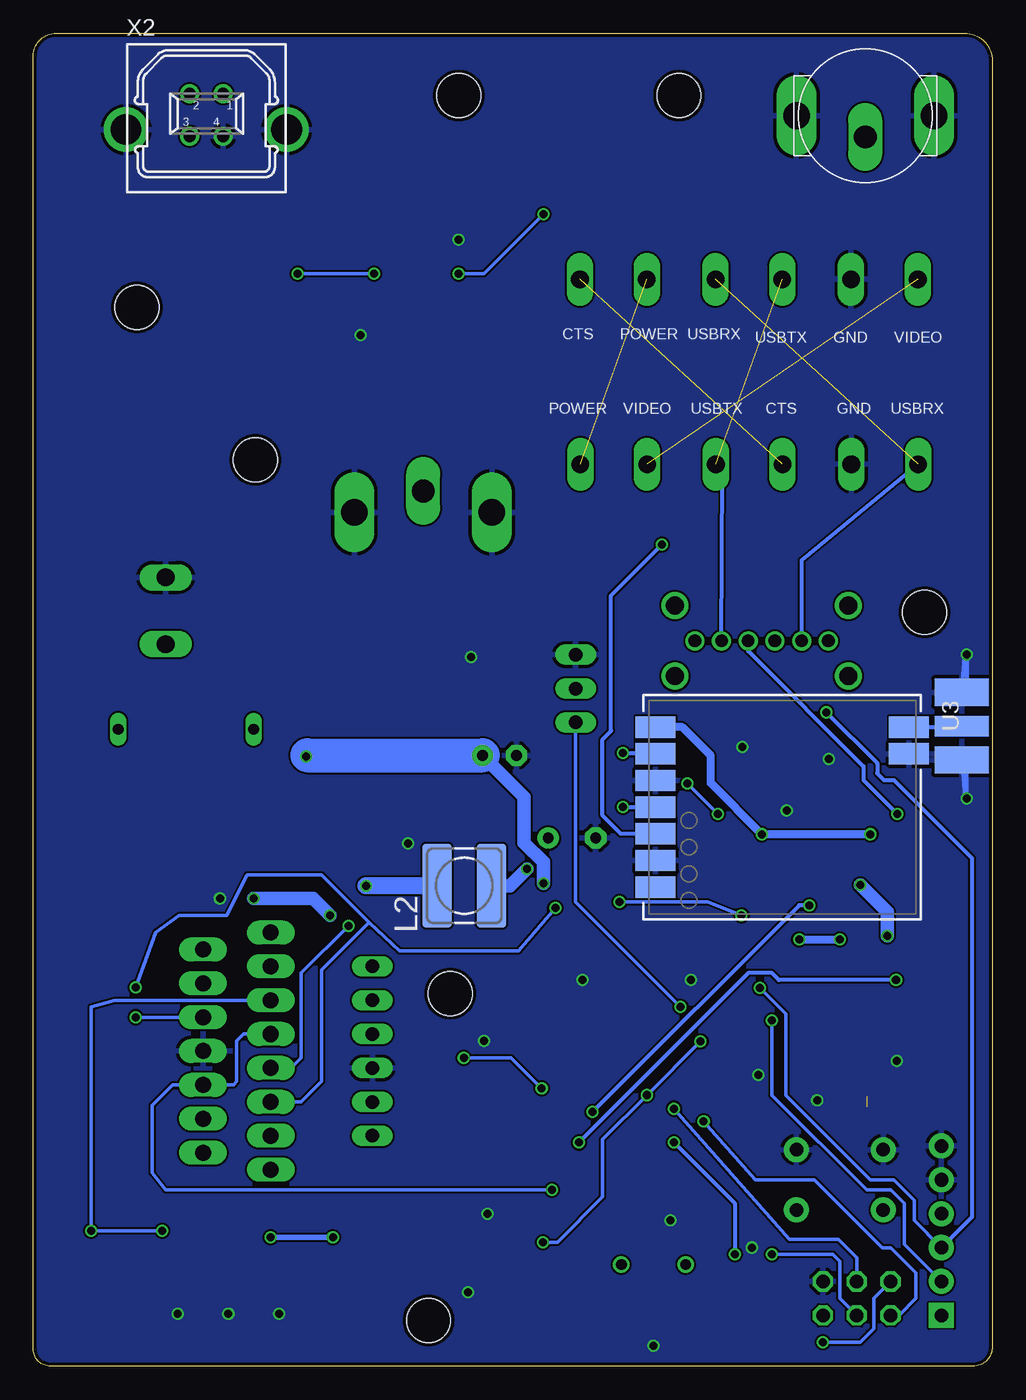
[diagram p6: board, bottom side, seen from below]

Size 71.9 x 99.92 mm. Coordinates in mm from the lower left corner, seen from the top.
Outline: 0,97.87 0,1.44 arc90 1.44,0 70.62,0 arc90 71.9,1.28 71.9,98.22 arc90 70.2,99.92 2.05,99.92 arc90 0,97.87
Copper layers (1*2*15*16): Top 0.035mm / dielectric 0.2mm / Route2 0.0175mm / dielectric 1.1mm / Route15 0.0175mm / dielectric 0.2mm / Bottom 0.035mm
Design rules "SeeedStudio_DRU_no_angle_20130527": minimum track width 6mil, minimum drill 12mil, track to track 6mil, track to pad 6mil, pad to pad 6mil, via to via 6mil, smd to smd 0mil, copper to edge 10mil, drill to drill 10mil, minimum pad ring 6mil, minimum via ring 6mil, stop-mask expansion 2mil, vias tented up to drill 25mil, thermal gap 10mil

### Footprints (pad centres in the part's own frame; a part is rotated, then mirrored left to right if it is on the bottom)
0603-CAP = smd 1.1 x 1: 1 -0.85,0; 2 0.85,0
0402-CAP = smd 0.7 x 0.9: 1 -0.65,0; 2 0.65,0
EIA3216 = smd 1.4 x 1.6: A 1.4,0; C -1.4,0
C0603K = smd 1.05 x 1.08: 1 -0.875,0; 2 0.875,0
C0805K = smd 1.3 x 1.6: 1 -1,0; 2 1,0
E2,5-6E = drill 0.813 pad 1.575: + -1.27,0 | drill 0.813 pad 1.575 octagon: - 1.27,0
E3,5-8 = drill 0.813 pad 1.6: + -1.778,0 | drill 0.813 pad 1.6 octagon: - 1.778,0
CHIP-LED0805 = smd 1.2 x 1.2: A 0,-1.05; C 0,1.05
DO214AC = smd 1.8 x 1.7: A 2.05,0; C -2.05,0
SOD123 = smd 1.4 x 1.4: A 1.9,0; C -1.9,0
PICOFUSE = drill 0.813 long: 1 -5.08,0; 2 5.08,0
TQFP100 = smd 1.5 x 0.35: 1 -8,6; 2 -8,5.5; 3 -8,5; 4 -8,4.5; 5 -8,4; 6 -8,3.5; 7 -8,3; 8 -8,2.5; 9 -8,2; 10 -8,1.5; 11 -8,1; 12 -8,0.5; 13 -8,0; 14 -8,-0.5; 15 -8,-1; 16 -8,-1.5; 17 -8,-2; 18 -8,-2.5; 19 -8,-3; 20 -8,-3.5; 21 -8,-4; 22 -8,-4.5; 23 -8,-5; 24 -8,-5.5; 25 -8,-6; 51 8,-6; 52 8,-5.5; 53 8,-5; 54 8,-4.5; 55 8,-4; 56 8,-3.5; 57 8,-3; 58 8,-2.5; 59 8,-2; 60 8,-1.5; 61 8,-1; 62 8,-0.5; 63 8,0; 64 8,0.5; 65 8,1; 66 8,1.5; 67 8,2; 68 8,2.5; 69 8,3; 70 8,3.5; 71 8,4; 72 8,4.5; 73 8,5; 74 8,5.5; 75 8,6 | smd 0.35 x 1.5: 26 -6,-8; 27 -5.5,-8; 28 -5,-8; 29 -4.5,-8; 30 -4,-8; 31 -3.5,-8; 32 -3,-8; 33 -2.5,-8; 34 -2,-8; 35 -1.5,-8; 36 -1,-8; 37 -0.5,-8; 38 0,-8; 39 0.5,-8; 40 1,-8; 41 1.5,-8; 42 2,-8; 43 2.5,-8; 44 3,-8; 45 3.5,-8; 46 4,-8; 47 4.5,-8; 48 5,-8; 49 5.5,-8; 50 6,-8; 76 6,8; 77 5.5,8; 78 5,8; 79 4.5,8; 80 4,8; 81 3.5,8; 82 3,8; 83 2.5,8; 84 2,8; 85 1.5,8; 86 1,8; 87 0.5,8; 88 0,8; 89 -0.5,8; 90 -1,8; 91 -1.5,8; 92 -2,8; 93 -2.5,8; 94 -3,8; 95 -3.5,8; 96 -4,8; 97 -4.5,8; 98 -5,8; 99 -5.5,8; 100 -6,8
MULTIWATT-15 = drill 1.2 long: 1 -8.89,-7.62; 2 -7.62,-2.54; 3 -6.35,-7.62; 4 -5.08,-2.54; 5 -3.81,-7.62; 6 -2.54,-2.54; 7 -1.27,-7.62; 8 0,-2.54; 9 1.27,-7.62; 10 2.54,-2.54; 11 3.81,-7.62; 12 5.08,-2.54; 13 6.35,-7.62; 14 7.62,-2.54; 15 8.89,-7.62
SOIC8 = smd 0.6 x 2.2: 1 -1.905,-2.6; 2 -0.635,-2.6; 3 0.635,-2.6; 4 1.905,-2.6; 5 1.905,2.6; 6 0.635,2.6; 7 -0.635,2.6; 8 -1.905,2.6
2X03 = drill 1.016 octagon: 1 -2.54,-1.27; 2 -2.54,1.27; 3 0,-1.27; 4 0,1.27; 5 2.54,-1.27; 6 2.54,1.27
DF13C-6P-1.25V = smd 0.7 x 1.8: 1 -3.125,0.9; 2 -1.875,0.9; 3 -0.625,0.9; 4 0.625,0.9; 5 1.875,0.9; 6 3.125,0.9 | smd 1.6 x 2.2: M$0 5.575,-1.8; M$1 -5.575,-1.8
SMA-EDGE = smd 2.032 x 4.064: GND@0 -2.54,0; GND@1 2.54,0 | smd 2.032 x 4.064 bottom: GND@2 -2.54,0; GND@3 2.54,0 | smd 1.524 x 4.064: SIG 0,0
FTDI_DEVICE_SIDE = drill 1.016 pad 1.88 square: P$1 -6.35,0 | drill 1.016 pad 1.88: P$2 -3.81,0; P$3 -1.27,0; P$4 1.27,0; P$5 3.81,0; P$6 6.35,0
POWER-CHOKE_WE-TPC = smd 6.3 x 2.2: 1 0,2.05; 2 0,-2.05
0402-IND = smd 0.5 x 0.6: P$1 -0.5,0; P$2 0.5,0
SML0805 = smd 1.2 x 1.2: A 1.05,0; C -1.05,0
HC49/S = drill 0.813: 1 -2.413,0; 2 2.413,0
SOT23-3 = smd 0.8 x 0.9: 1 -0.95,-1; 2 0.95,-1; 3 0,1.1
0402-RES = smd 0.7 x 0.9: 1 -0.65,0; 2 0.65,0
R0805 = smd 1.3 x 1.5: 1 -0.85,0; 2 0.85,0
R0603 = smd 1 x 1.1: 1 -0.85,0; 2 0.85,0
R0805' = smd 1.1 x 1.4: 1 -1,0; 2 1,0
M0805 = smd 1.3 x 1.6: 1 -0.95,0; 2 0.95,0
MSS22 = drill 0.95: 1 2.65,11.5; 2 2.65,9.5; 3 2.65,7.5; 4 2.65,5.5; 5 2.65,3.5; 6 2.65,1.5 | drill 1.35: NC@1 0,13; NC@2 5.3,13; NC@3 0,0; NC@4 5.3,0
TACTILE-PTH = drill 1.016 pad 1.88: 1 -3.251,2.261; 2 3.251,2.261; 3 -3.251,-2.261; 4 3.251,-2.261
STAND-OFF = hole 3.302: 0,0
MA06-1 = drill 1.016 long: 1 -6.35,0; 2 -3.81,0; 3 -1.27,0; 4 1.27,0; 5 3.81,0; 6 6.35,0
MA03-1 = drill 1.016 long: 1 -2.54,0; 2 0,0; 3 2.54,0
SOT23-5 = smd 0.55 x 1.2: 1 -0.95,-1.3; 2 0,-1.3; 3 0.95,-1.3; 4 0.95,1.3; 5 -0.95,1.3
HM-TRP-SMD = smd 1.6 x 3: !CONFIG 2,-9.5; !ENABLE 4,-9.5; AGND -4,9.5; ANT -6,9.5; DRX 0,-9.5; DTX -4,-9.5; GND -2,-9.5; TEST 6,-9.5; VCC -6,-9.5
SSOP28DB = smd 0.348 x 1.397: 1 -4.225,-3.656; 2 -3.575,-3.656; 3 -2.925,-3.656; 4 -2.275,-3.656; 5 -1.625,-3.656; 6 -0.975,-3.656; 7 -0.325,-3.656; 8 0.325,-3.656; 9 0.975,-3.656; 10 1.625,-3.656; 11 2.275,-3.656; 12 2.925,-3.656; 13 3.575,-3.656; 14 4.225,-3.656; 15 4.225,3.656; 16 3.575,3.656; 17 2.925,3.656; 18 2.275,3.656; 19 1.625,3.656; 20 0.975,3.656; 21 0.325,3.656; 22 -0.325,3.656; 23 -0.975,3.656; 24 -1.625,3.656; 25 -2.275,3.656; 26 -2.925,3.656; 27 -3.575,3.656; 28 -4.225,3.656
DPAK = smd 1.6 x 3: 1 -2.28,-5.31; 3 2.28,-5.31 | smd 4.826 x 5.715: 4 0,1.588
LGA-24 = smd 0.7 x 0.29: 1 -1.875,1.25; 2 -1.875,0.75; 3 -1.875,0.25; 4 -1.875,-0.25; 5 -1.875,-0.75; 6 -1.875,-1.25; 13 1.875,-1.25; 14 1.875,-0.75; 15 1.875,-0.25; 16 1.875,0.25; 17 1.875,0.75; 18 1.875,1.25 | smd 0.29 x 0.7: 7 -1.25,-1.875; 8 -0.75,-1.875; 9 -0.25,-1.875; 10 0.25,-1.875; 11 0.75,-1.875; 12 1.25,-1.875; 19 1.25,1.875; 20 0.75,1.875; 21 0.25,1.875; 22 -0.25,1.875; 23 -0.75,1.875; 24 -1.25,1.875
RCA_VERTICAL = drill 2 long: P$1 -5.15,0; P$2 5.15,0 | drill 1.7 long: P$3 0,1.6
AK300/2 = drill 1.321 long: 1 -2.515,0; 2 2.489,0
KUSBVX-BS1N = drill 0.9 pad 1.422: 1 1.25,2.7; 2 -1.25,2.7; 3 -1.25,-0.5; 4 1.25,-0.5 | drill 2.3 pad 2.7: M1 -6.02,0; M2 6.02,0

### Placement (x,y rotation side)
C3  58.55,36.96 180 top
C6  11.18,44.2 90 top
C7  13.72,41.66 0 top
C8  18.8,42.93 270 top
C9  35.28,85.85 270 top
C10  47.37,79.98 270 top
C11  6.96,19.45 180 top
C12  4.07,22.45 90 top
C13  37.57,50.88 90 top
C14  10.27,19.45 0 top
C15  47.75,56.39 180 top
C16  45.16,36.46 90 top
C17  40.11,50.88 90 top
C18  7.62,1.27 180 top
C19  27.94,2.54 90 top
C20  36.94,45.79 180 top
C21  31.52,39.59 180 top
C22  22.86,2.54 90 top
C23  17.53,23.88 270 top
C24  23.37,12.19 0 top
C25  38.1,22.1 90 top
C26  31.75,33.02 180 top
C27  22.1,32.77 0 top
C28  12.36,23.74 90 top
CHRG/LBO5  17.78,11.43 180 top
D1  55.37,41.4 270 top
D2  65.53,41.4 270 top
D3  51.56,41.4 270 top
D4  59.18,41.4 270 top
D5  59.18,5.84 270 top
D6  51.56,5.84 270 top
D7  62.99,5.84 270 top
D8  55.37,5.84 270 top
D10  46.18,41.12 180 top
F2  60.45,47.75 0 top
IC1  27.94,22.86 0 top
IC2  61.72,23.62 270 top
IC3  40.1,35.06 90 top
ICSP  10.16,5.08 0 top
J203  36.83,6.99 270 top
J$1  2.29,47.98 270 bottom
JP1  3.81,10.16 90 top
L2  39.58,36.02 90 bottom
L4  25.4,45.97 0 top
L5  25.4,41.91 0 top
L6  48.26,94.74 270 top
LED1  47.88,84.84 90 top
LED2  47.85,86.72 90 top
LED3  42.42,20.07 180 top
LED4  42.42,22.1 0 top
Q8  25.4,7.62 180 top
Q11  11.43,34.29 0 top
Q12  6.35,34.29 180 top
R1  47.83,83.19 180 top
R2  47.8,88.39 180 top
R4  47.75,10.67 90 top
R6  34.82,34.38 90 top
R7  40.94,41.06 180 top
R8  37.28,41.05 0 top
R16  10K  [R0805']  16.51,5.08 90 top
R23  10K  [R0805']  11.43,30.48 180 top
R24  10K  [R0805']  11.43,38.1 180 top
R31  10K  [R0805']  6.35,38.1 0 top
R32  10K  [R0805']  6.35,30.48 0 top
R33  17.78,16.51 270 top
S1  10.79,57.02 270 top
S2  11.43,13.97 180 top
STANDOFF1  23.5,95.25 0 top
STANDOFF2  64.14,79.38 0 top
STANDOFF3  40.01,95.25 0 top
STANDOFF4  5.08,56.52 0 top
STANDOFF5  40.64,27.94 0 top
STANDOFF6  55.24,67.94 0 top
STANDOFF7  42.27,3.43 0 top
SV1  46.48,23.62 90 top
SV3  31.24,50.8 90 top
U2  14.99,44.2 90 top
U3  15.75,41.91 270 bottom
U4  40.64,84.58 270 top
U5  49,50.88 270 top
U6  7.87,23.55 0 top
U$10  42.67,64.01 0 top
U$11  9.53,93.75 180 bottom
X1  18.21,67.61 180 top
X2  58.93,92.71 0 bottom
X3  28.37,67.61 180 top
X4  61.98,56.64 90 top
X6  8.05,67.61 180 top
X7  18.24,81.48 180 top
X8  28.4,81.48 180 top
X10  8.08,81.48 180 top

### Tracks (layer width: path | path; a pad name or v marks a point on that pad's centre or on a via)
+3V3  (via drill 0.6)  (1 unrouted)
  Top 0.254: U6.23 U6.22 | U6.19 U6.20 | U6.17 U6.18 10.08,25.14 10.79,25.14 10.79,21.59 9.41,20.21 | U6.17 U6.16 U6.15 | 7.62,24.77 8.26,24.13 9.57,24.13 U6.17
  Top 0.305: C28.A 10.79,25.14 | U6.19 U6.18 | 7.62,24.77 U6.22
  Top 0.406: R31.2 7.35,35.29 Q12.1 9.3,33.29 Q11.1 10.43,33.24 10.43,32.26 R23.2 | U2.5 14.54,43.25 15.24,42.55 16.51,42.55 17.27,41.78 v17.27,39.88
  Top 0.61: R31.2 v9.13,39.88 | v14.48,32 14.48,29.72 12.36,27.6 C28.A | v11.43,32 11.43,32.26 10.43,32.26 | v17.27,39.88 18.8,41.4 C8.A
  Bottom 0.61: v9.13,39.88 v17.27,39.88 21.11,43.71 21.11,45.77 23.25,47.91 U3.VCC | v14.48,32 v11.43,32
+5V  (via drill 0.6)
  Top 0.254: 24.41,13.97 24.46,14.8 IC1.31 24.44,15.8 25.91,17.27 v25.91,20.32 28.57,20.32 31.94,23.69 | IC1.61 33.77,21.86 31.94,23.69 | 31.94,23.69 IC1.80 | v21.87,24.36 IC1.10 | 49.51,50.11 50.01,50.62 50.33,50.62 U5.4 | C24.1 22.49,9.54 19.3,6.35 19.3,3.81 17.27,1.78 v12.7,1.78 | IC1.100 21.94,31.91 21.08,32.77 | SV1.4 47.24,24.89 48.51,26.16 48.51,32.51 v48.26,33.02
  Top 0.305: C26.1 31.94,32.34 IC1.80 | C27.1 21.94,32.05 IC1.100 | C25.1 37.21,21.86 IC1.61 | C23.1 18.43,24.36 IC1.10 | C24.1 22.49,12.33 23.37,13.21 23.62,13.21 24.41,13.97 | v33.68,9.3 34.12,8.86 J203.2
  Top 0.406: R16.2 15.51,5.08 8.89,5.08 ICSP.2 7.62,7.62 JP1.P$4 | U2.3 15.58,45.15 15.04,44.6 15.04,43.81 15.61,43.25 U2.1
  Top 0.61: 49.51,50.11 49.53,36.32 48.26,35.05 v48.26,33.02 46.35,33.02 44.45,31.11 36.83,31.11 36.07,32.26 33.39,32.26 C26.1 31.61,34.04 29.21,34.04 29.21,33.94 28.29,33.02 26.42,33.02 25.4,34.04 22.35,34.04 21.08,32.77 | C15.1 48.77,56.4 | C6.1 11.18,42.39 10.43,41.64 | 13.72,46.74 14.7,46.74 U2.3
  Top 1.016: C15.1 50.61,54.53 U5.4 | R32.2 7.35,31.73 v7.87,32.26 | v9.91,36.07 9.91,37.58 R24.2 10.43,41.64 9.4,42.67 9.4,45.72 10.41,46.74 | 10.41,46.74 13.72,46.74 | 48.77,56.4 48.77,58.17 45.47,58.17 44.2,55.63 28.45,55.63 25.15,58.93 9.91,58.93 8.89,57.91 8.89,48.26 10.41,46.74
  Bottom 0.254: v21.87,24.36 v25.91,20.32 29.21,17.02 29.21,12.7 32.61,9.3 v33.68,9.3 | IC2.9 52.58,22.35 51.82,23.11 51.82,29.46 v48.26,33.02 | v12.7,1.78 9.91,1.78 8.89,2.79 8.89,5.08 ICSP.2
  Bottom 1.016: v7.87,32.26 7.87,34.04 v9.91,36.07
+7V  (via drill 0.6)
  Top 0.254: C17.1 39.98,49.88 | C13.1 36.89,50.3
  Top 0.406: 41.37,48.6 41.88,48.6 U5.3 | 40.11,49.86 C17.1
  Top 1.016: 41.37,48.6 40.11,49.86 | 41.88,48.6 41.91,45.1 39.99,43.18 37.47,43.18 36.44,42.15 R8.1 34.9,40.02 | 39.98,49.88 C13.1 34.89,49.88 33.97,50.8 SV3.2 | 34.9,40.02 v34.9,37.29 | 34.9,40.02 34.47,39.59 C21.+
  Bottom 1.016: v34.9,37.29 36.17,36.02 L2.2
+12V  (via drill 0.6)
  Top 0.406: D4.C 62.36,42.82 | C3.1 62.99,36.96
  Top 0.813: R6.2 35.29,35.69 IC3.6
  Top 1.016: D3.C 51.44,43.58 | v33.66,36.2 34.62,35.23 R6.2
  Top 2.54: 62.36,42.82 62.99,36.96 62.99,29.97 61.09,28.7 IC2.4 | F2.2 D2.C D4.C D1.C D3.C | 51.44,43.58 v51.44,45.72
  Bottom 1.016: v51.44,45.72 51.37,45.79 | C20.+ 35.1,42.68 35.1,39.24 33.66,37.8 v33.66,36.2
  Bottom 2.54: 51.37,45.79 C20.+
CTS  (via drill 0.6)  (1 unrouted)
  Top 0.254: U4.11 33.11,82.31 X8.1
  Top 0.305: v24.77,61.59 19.05,61.59 15.8,63.3 15.8,67.54 X1.2
  Bottom 0.305: U3.!CONFIG 27.84,39.91 29.21,41.27 29.21,46.99 28.57,47.62 28.57,57.78 v24.77,61.59
ENABLE  (via drill 0.6)
  Top 0.254: IC1.1 18.8,30 v18.8,33.78 | v27.94,34.8 32.38,34.8 v32.77,34.34 | v64.24,26.16 v64.24,28.4
  Bottom 0.254: v18.8,33.78 21.34,34.8 v27.94,34.8 | v32.77,34.34 35.53,31.11 44.45,31.11 46.74,33.27 | 46.74,33.27 50.29,29.72 50.29,21.34 51.82,19.81 IC2.11 | IC2.6 v64.24,26.16 | v64.24,28.4 62.74,32.51 60.96,33.78 57.4,33.78 55.88,36.83 50.29,36.83 46.74,33.27
ENCA
  Top 0.254: IC1.60 36.81,21.36 37.08,21.08 37.08,20.57 37.34,20.32 38.86,20.32 39.12,20.57 39.12,21.59 40.23,21.59 40.49,22.81 41.4,23.88 42.93,23.88 SV1.5
ENCB  (via drill 0.6)
  Top 0.254: SV1.6 45.97,29.97 44.45,28.45 44.45,26.92 42.16,24.64 41.15,24.64 v39.62,23.11 | v33.78,20.83 35.91,20.83 IC1.59
  Bottom 0.254: v39.62,23.11 36.07,23.11 v33.78,20.83
GND  (via drill 0.6)
  Top 0.254: v18.03,8.89 18.03,10.13 CHRG/LBO5.C | C23.2 v17.53,21.84 | IC1.99 22.44,29.12 v22.61,28.96 | C13.2 40.09,51.88 40.11,51.89 39.09,52.91 v39.09,53.16 | C25.2 v38.1,24.38 | v30.73,28.96 31.44,29.66 IC1.81 | U4.26 U4.25 42.41,86.86 v40.01,84.45 | C9.2 35.58,84.91 U4.7 39.55,84.91 v40.01,84.45 | v47.37,77.29 C10.2 | v40.01,84.45 40.2,84.26 U4.21 | U4.18 42.15,82.31 v40.01,84.45 | C12.2 U6.4 | U6.2 U6.3 U6.4 | U6.4 U6.5 U6.6
  Top 0.305: IC1.32 24.94,13.9 C24.2 24.13,12.08 v24.13,10.92 | C26.2 31.44,32.45 IC1.81 | C27.2 22.44,31.98 IC1.99 | C25.2 37.23,22.36 IC1.62 | C23.2 18.39,23.86 IC1.11 | v1.91,53.34 1.91,50.8 | v1.91,42.55 1.91,45.09 | v1.91,53.34 2.06,53.19 J$1.GND@2 1.91,50.6 v1.91,53.34 | v1.91,42.55 2.06,42.7 J$1.GND@3 1.91,45.21 v1.91,42.55 | J203.5 38.89,5.11 v39.32,5.54 | v37.85,11.43 37.85,10.23 J203.1 | U6.5 6.08,22.89 v7.16,22.89 | v13.13,19.94 12.38,20.7 12.36,20.7
  Top 0.406: C3.2 57.91,36.96 v57.91,35.05 | v53.47,3.94 53.32,3.79 | C22.1 25.4,1.67 | 25.4,1.67 C19.1 | v25.4,1.52 25.4,1.67 | C15.2 45.06,53.17 U5.1 41.37,53.16 40.11,51.89 C17.2 | C16.2 44.8,36.96 IC3.4 | D10.A 44.23,41.06 R7.1
  Top 0.61: U2.2 18.67,44.2 C8.C 18.75,44.38 v18.75,46.41 | C6.2 11.6,44.85 v12.27,45.52 | C7.2 v15.42,41.66 | C14.2 12.36,20.7 C28.C
  Top 0.813: D10.A 45.16,40.24 45.16,39.19 C16.2
  Top 1.016: D6.A 53.32,3.79 D8.A D5.A D7.A
  Top 1.27: v43.79,39.19 45.16,39.19
  Bottom 0.254: v22.61,28.96 22.35,29.21
  Bottom 0.305: J$1.GND@2 2.06,53.19 v1.91,53.34 1.91,50.6 J$1.GND@2 | J$1.GND@3 2.06,42.7 v1.91,42.55 1.91,45.21 J$1.GND@3
  other vias: 57.28,3.94 61.09,3.94
  pour Bottom (rank 3): -1.27,101.6 75.16,101.2 75.16,-1.67 -1.27,-1.27
LEFT  (via drill 0.6)
  Top 0.254: IC1.48 32.94,15.92 33.27,16.26 34.54,16.26 46.48,4.32 46.48,2.79 48.77,0.51 65.28,0.51 68.07,3.3 68.07,8.38 v67.56,10.16 | v62.23,10.16 62.23,17.53 61.21,18.54 IC2.12
  Bottom 0.254: v62.23,10.16 v67.56,10.16 67.56,26.92 65.79,27.43 IC2.5
MISO  (via drill 0.6)
  Top 0.254: v21.64,18.36 IC1.22
  Bottom 0.254: ICSP.1 6.99,3.81 5.71,5.08 5.71,6.99 7.62,8.89 8.26,8.89 13.34,13.97 17.78,13.97 v21.64,18.36
MOSI  (via drill 0.6)
  Top 0.254: v23.88,19.3 21.65,19.3 20.96,18.86 IC1.21
  Bottom 0.254: ICSP.4 10.16,8.13 11.56,9.53 15.21,9.53 v23.88,19.3
N$2
  Top 0.406: U2.4 12.45,43.91 12.45,42.22 13.01,41.66 C7.1
N$5
  Bottom 0.305: U3.ANT 2.06,47.91 J$1.SIG
N$6  (via drill 0.6)
  Top 0.254: U4.4 35.64,86.86 C9.1 35.14,86.36 v33.66,86.36 | U4.17 40.26,81.66 v40.01,81.92
  Bottom 0.254: v40.01,81.92 38.1,81.92 v33.66,86.36
N$7
  Top 0.254: U6.9 7.62,19.65 C11.1
N$8
  Top 0.305: LED4.C LED3.A 41.4,18.8 41.4,18.03 44.7,14.73 44.7,10.16 49.27,5.6
  Top 0.406: 62.99,8.38 D7.C 63.48,7.89 | 49.27,5.6 49.02,5.35
  Top 1.016: D3.A 51.56,29.97 | 51.56,29.97 51.56,17.27 | 51.56,17.27 D6.C 49.27,5.6 | IC2.3 51.56,29.97 | IC2.13 51.56,17.27 | D2.A 65.53,9.65 62.99,8.38 | 49.02,5.35 49.02,3.3 50.29,2.03 64.26,2.03 65.53,3.3 65.53,5.84 63.48,7.89 | 51.56,17.27 SV1.1
N$9  (via drill 0.6)
  Top 0.254: X2.2 59.05,94.29 59.05,88.9 v52.07,81.92 | v46.35,81.92 45.45,81.01 U4.16
  Bottom 0.254: v52.07,81.92 v46.35,81.92
N$10  (via drill 0.6)
  Top 0.305: R4.1 v49.44,9.65
  Top 0.406: v54.1,9.65 55.37,8.38 D8.C
  Top 1.016: D5.C D8.C 56.64,9.16 56.64,16 | 56.64,31.24 56.64,33.78 v55.37,35.05 D1.A D4.A | 56.64,31.24 56.64,16 | IC2.2 56.64,31.24 | IC2.14 56.64,16 | SV1.2 49.02,19.81 49.66,20.45 v49.66,33.78
  Bottom 0.406: v49.44,9.65 v54.1,9.65
  Bottom 1.016: v49.66,33.78 50.93,35.05 v55.37,35.05
N$11
  Top 0.254: R2.1 48.45,86.87 LED2.A
N$12
  Top 0.254: R1.1 48.48,84.69 LED1.A
N$13
  Top 0.305: LED4.A LED3.C 43.47,17.53 47.75,13.24 R4.2
N$14
  Top 0.254: U4.23 45.95,85.56 LED2.C
N$15
  Top 0.254: LED1.C 44.3,84.84 U4.22
N$16  (via drill 0.6)
  Top 0.305: L4.P$2 v27.69,45.97
  Bottom 0.305: v27.69,45.97 25.31,45.97 U3.DTX
N$17  (via drill 0.6)
  Top 0.305: L5.P$2 v27.69,41.91
  Bottom 0.305: v27.69,41.91 U3.DRX
N$18
  Top 0.406: C18.2 6.35,1.27 JP1.P$1
N$19
  Top 0.406: IC3.3 45.05,35.69 C16.1
N$20
  Top 0.305: Q8.1 25.94,9.49 IC1.34
  Top 0.406: C19.2 27.81,3.42 Q8.1
N$21
  Top 0.305: Q8.2 25.44,10.07 IC1.33
  Top 0.406: C22.2 22.99,3.42 Q8.2
N$22  (via drill 0.6)
  Top 0.254: v30.99,16.76 30.99,14.91 IC1.44
  Top 0.305: R32.1 5.35,30.21 v7.21,28.96
  Top 0.406: R32.1 5.35,32.19 Q12.3
  Bottom 0.305: v7.21,28.96 16,28.96 16.51,29.46 18.29,29.46 v30.99,16.76
N$23
  Top 0.406: X2.1 57.51,95.24 L6.P$1
N$24  (via drill 0.6)
  Top 0.305: Q11.3 12.87,35.39 v13.72,34.54 | v29.97,19.05 29.97,16.26 30.44,15.79 IC1.43
  Top 0.406: R24.1 12.43,36.39 Q11.3
  Bottom 0.305: v13.72,34.54 14.48,34.54 v29.97,19.05
N$25
  Top 1.016: X4.1 61.75,54.13
  Top 2.54: 61.75,54.13 F2.1
N$26
  Top 0.254: U4.15 44.3,78.26 46.99,75.56 48.9,75.56 60.18,86.85 X2.3
N$27
  Top 0.406: CHRG/LBO5.A R33.2
N$28
  Top 0.254: C11.2 6.12,20.09 7.12,21.09 U6.8
N$29
  Top 0.254: C12.1 6.54,21.6 U6.7
N$30
  Top 0.813: R6.1 35.2,33.15 IC3.8
  Top 1.016: IC3.7 IC3.8 IC3.1
N$31
  Top 0.61: R7.2 39.78,40.9 R8.2 37.47,40.38 37.47,39.37 37.48,36.99 IC3.5
N$32  (via drill 0.6)
  Top 0.61: IC3.2 46.64,34.42 46.97,34.75 v46.97,36.02
  Top 1.27: v46.97,36.02 48.09,37.14 D10.C
  Bottom 1.27: L2.1 v46.97,36.02
POWER  (1 unrouted)
RESET1  (via drill 0.6)
  Top 0.254: S2.2 S2.1
  Top 0.305: S2.1 14.68,7.67 15.24,7.11 17.27,7.11 17.65,6.73 | 17.65,6.73 17.78,6.6 17.78,5.35 R16.1 | IC1.30 23.94,16.7 v23.88,16.76 | v19.3,8.38 17.65,6.73
  Top 0.406: C18.1 10.16,1.27 ICSP.5 16.24,3.81 R16.1
  Bottom 0.305: v23.88,16.76 19.3,12.19 v19.3,8.38
RIGHT  (via drill 0.6)
  Top 0.254: IC1.47 32.44,13.79 v33.02,13.21
  Bottom 0.254: v33.02,13.21 61.98,13.21 62.99,14.48 62.99,19.56 61.47,21.08 IC2.10 56.9,21.08 56.64,21.34 56.64,24.38 56.13,24.89 IC2.7
RX  (via drill 0.6)
  Top 0.254: v17.44,28.36 IC1.2
  Top 0.305: S1.6 12.45,54.22 v12.45,49.02
  Bottom 0.254: JP1.P$3 5.84,10.92 5.84,12.45 7.37,13.97 9.14,13.97 15.49,20.32 15.49,26.42 v17.44,28.36
  Bottom 0.305: v12.45,49.02 8.64,45.21 8.64,44.45 8.13,43.94 7.37,43.94 1.52,38.1 1.52,11.18 JP1.P$3
RX1
  Top 0.305: IC1.45 31.44,8.95 34.03,6.36 J203.4
SCK  (via drill 0.6)
  Top 0.254: v16.51,8.38 16.51,17.02 16.76,17.27 17.34,17.27 R33.1
  Top 0.305: R33.1 17.78,18.54 18.8,19.3 18.85,19.36 IC1.20
  Bottom 0.254: ICSP.3 11.43,5.08 11.43,7.87 11.94,8.38 v16.51,8.38
SCL
  Top 0.305: U6.21 8.12,25.89 12.43,30.21
  Top 0.406: Q11.2 12.38,30.53 R23.1 12.43,30.21
SDA
  Top 0.305: U6.24 6.62,26.41 3.81,29.21 3.81,33.02 5.4,34.61 Q12.2
  Top 0.406: Q12.2 5.35,35.29 R31.1
SERVO  (via drill 0.6)
  Top 0.254: IC1.5 19.95,26.85 v23.37,26.92
  Bottom 0.254: v23.37,26.92 31.24,34.8 SV3.1
TELEM_RX
  Top 0.254: S1.4 22.1,48.57 22.1,41.91 | 22.1,41.91 L5.P$1 | IC1.13 20.83,22.86 21.84,23.37 23.11,23.37 24.38,24.64 24.38,27.18 23.88,27.94 22.35,27.94 19.81,30.99 19.81,38.35 22.1,40.89 22.1,41.91
TELEM_TX  (via drill 0.6)
  Top 0.254: S1.1 22.1,54.18 22.1,49.78 23.11,48.77 23.11,45.97 | 23.11,45.97 L4.P$1 | IC1.12 18.79,23.36 18.54,23.11 18.54,21.59 18.03,20.83 16.26,20.83 15.49,21.84 15.49,27.94 17.78,29.97 17.78,37.85 20.57,40.64 v20.57,41.4 | v22.86,43.69 22.86,45.72 23.11,45.97
  Bottom 0.254: v20.57,41.4 v22.86,43.69
TX  (via drill 0.6)
  Top 0.254: v16.51,25.91 18.46,27.86 IC1.3
  Top 0.305: v7.11,41.4 6.1,41.4 1.52,36.83 1.52,8.64 JP1.P$2
  Bottom 0.254: JP1.P$2 6.6,9.14 6.6,12.19 7.62,13.21 9.4,13.21 16.51,20.32 v16.51,25.91
  Bottom 0.305: S1.3 18.3,53.6 9.65,44.96 9.65,43.94 v7.11,41.4
TX1
  Top 0.305: IC1.46 31.94,9.72 34.05,7.61 J203.3
USBRX  (1 unrouted)
  Top 0.254: U4.1 29.45,88.81 X7.1
  Bottom 0.305: S1.5 14.29,60.43 X6.2
USBTX  (1 unrouted)
  Top 0.305: X7.2 26.44,90.81 36.83,90.81 38.73,88.9 38.73,87 37.95,86.21 U4.5
  Bottom 0.305: S1.2 20.22,67.11 X1.1
VCC
  Top 0.254: C10.1 47.37,82.99 R1.2 46.76,83.61 U4.20
  Top 0.406: L6.P$2 47.15,93.14 R2.2 46.99,88.56 46.99,89.53 47.62,90.17 50.16,90.17 50.8,89.53 50.8,82.55 48.91,80.86 C10.1
VIDEO  (1 unrouted)
  Top 0.305: U$10.P$3 37.95,70.79 28.85,70.71 26.47,67.61 X3.2 | U$11.P$3 5.56,87.76 X10.2

### Text on the board
tPlace: Video In | GND | DEBUG | RUN | GND | +7V | +12V | Signal | SmartTracker Rev 1.0 | RED | +5V | MOSI | GND | MISO | GPS | RESET | SCK
bPlace: VIDEO | GND | USBTX | USBRX | POWER | CTS | USBRX | GND | CTS | USBTX | VIDEO | POWER